# Altium schematic sheet 32-054原理图（源文件格式）.SchDoc
size A4
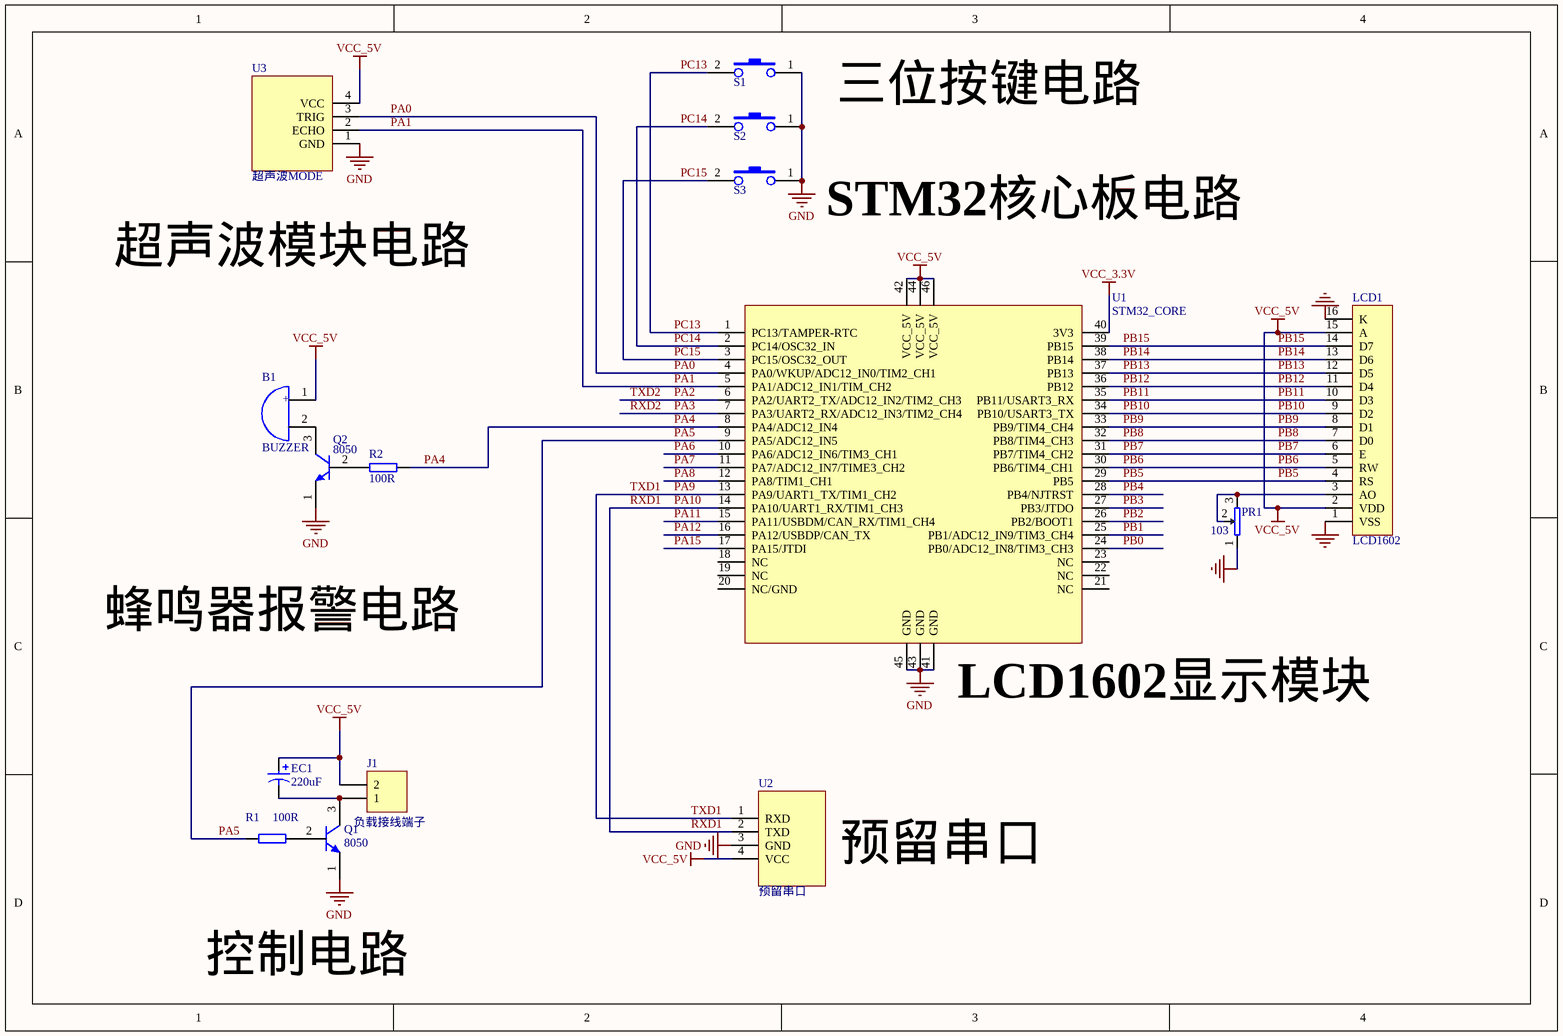
[diagram p0: 32-054原理图（源文件格式）.SchDoc]

## Parts
B1  BUZZER  [BUZZERSOT_PLASTIC]
EC1  220uF  [RB.15/.3]
J1  负载接线端子  [XH-2.54-2P]
LCD1  LCD1602  [LCD1602]
PR1  103  [WH06-2]
Q1  8050  [TO-92]
Q2  8050  [TO-92]
R1  100R  [AXIAL0.3]
R2  100R  [AXIAL0.3]
S1  BUTTOM  [BUTTOM_6x6DIP]  (value not drawn)
S2  BUTTOM  [BUTTOM_6x6DIP]  (value not drawn)
S3  BUTTOM  [BUTTOM_6x6DIP]  (value not drawn)
U1  STM32_CORE  [STM32_CORE]
U2  预留串口  [蓝牙MODE竖放]
U3  超声波MODE  [超声波MODE]

## Nets
GND: LCD1.1(VSS) LCD1.16(K) PR1.1 Q1.1 Q2.1 S1.1 S2.1 S3.1 U1.41(GND) U1.43(GND) U1.45(GND) U2.3(GND) U3.1(GND)
VCC_3.3V: U1.40(3V3)
VCC_5V: B1.1 EC1.1 J1.2 LCD1.2(VDD) LCD1.15(A) U1.42(VCC_5V) U1.44(VCC_5V) U1.46(VCC_5V) U2.4(VCC) U3.4(VCC)
PA0: U1.4(PA0/WKUP/ADC12_IN0/TIM2_CH1) U3.3(TRIG)
PA1: U1.5(PA1/ADC12_IN1/TIM_CH2) U3.2(ECHO)
PA2: U1.6(PA2/UART2_TX/ADC12_IN2/TIM2_CH3)  [also labelled TXD2]
PA3: U1.7(PA3/UART2_RX/ADC12_IN3/TIM2_CH4)  [also labelled RXD2]
PA4: R2.2 U1.8(PA4/ADC12_IN4)
PA5: R1.2 U1.9(PA5/ADC12_IN5)
PA6: U1.10(PA6/ADC12_IN6/TIM3_CH1)
PA7: U1.11(PA7/ADC12_IN7/TIME3_CH2)
PA8: U1.12(PA8/TIM1_CH1)
PA9: U1.13(PA9/UART1_TX/TIM1_CH2) U2.1(RXD)  [also labelled TXD1]
PA10: U1.14(PA10/UART1_RX/TIM1_CH3) U2.2(TXD)  [also labelled RXD1]
PA11: U1.15(PA11/USBDM/CAN_RX/TIM1_CH4)
PA12: U1.16(PA12/USBDP/CAN_TX)
PA15: U1.17(PA15/JTDI)
PB0: U1.24(PB0/ADC12_IN8/TIM3_CH3)
PB1: U1.25(PB1/ADC12_IN9/TIM3_CH4)
PB2: U1.26(PB2/BOOT1)
PB3: U1.27(PB3/JTDO)
PB4: U1.28(PB4/NJTRST)
PB5: LCD1.4(RS) U1.29(PB5)
PB6: LCD1.5(RW) U1.30(PB6/TIM4_CH1)
PB7: LCD1.6(E) U1.31(PB7/TIM4_CH2)
PB8: LCD1.7(D0) U1.32(PB8/TIM4_CH3)
PB9: LCD1.8(D1) U1.33(PB9/TIM4_CH4)
PB10: LCD1.9(D2) U1.34(PB10/USART3_TX)
PB11: LCD1.10(D3) U1.35(PB11/USART3_RX)
PB12: LCD1.11(D4) U1.36(PB12)
PB13: LCD1.12(D5) U1.37(PB13)
PB14: LCD1.13(D6) U1.38(PB14)
PB15: LCD1.14(D7) U1.39(PB15)
PC13: S1.2 U1.1(PC13/TAMPER-RTC)
PC14: S2.2 U1.2(PC14/OSC32_IN)
PC15: S3.2 U1.3(PC15/OSC32_OUT)
NetB1_2: B1.2 Q2.3
NetEC1_2: EC1.2 J1.1 Q1.3
NetLCD1_3: LCD1.3(AO) PR1.2 PR1.3
NetQ1_2: Q1.2 R1.1
NetQ2_2: Q2.2 R2.1

Not connected (* = marked no-connect by the designer): U1 18(NC) 19(NC) 20(NC/GND) 21(NC) 22(NC) 23(NC)

## Notes on the sheet
- 三位按键电路
- STM32核心板电路
- 超声波模块电路
- 蜂鸣器报警电路
- (near U1) LCD1602显示模块
- 预留串口
- 控制电路
- (in symbol BUZZER) +

## Library data of the parts
B1 = BUZZER: 蜂鸣器
EC1 = CAP_EC: 极性电容
J1 = CON2: 接线端子2芯; LatestRevisionDate: 17-Jul-2002; LatestRevisionNote: Re-released for DXP Platform.; Publisher: Altium Limited
LCD1 = LCD1602: LCD1602液晶
PR1 = PR: 电位器
Q1 Q2 = 9013: 三极管
R1 R2 = RES: 电阻
S1-S3 = BUTTOM: 按键
U1 = STM32_CORE: STM32核心板
U2 = 蓝牙MODE
U3 = 超声波MODE: 超声波模块